# EAGLE schematic CKT-2000 (EAGLE 9.6.0)
DWG_NUMBER: CKT-2000; REV: B; TITLE: PIMtector Control Board
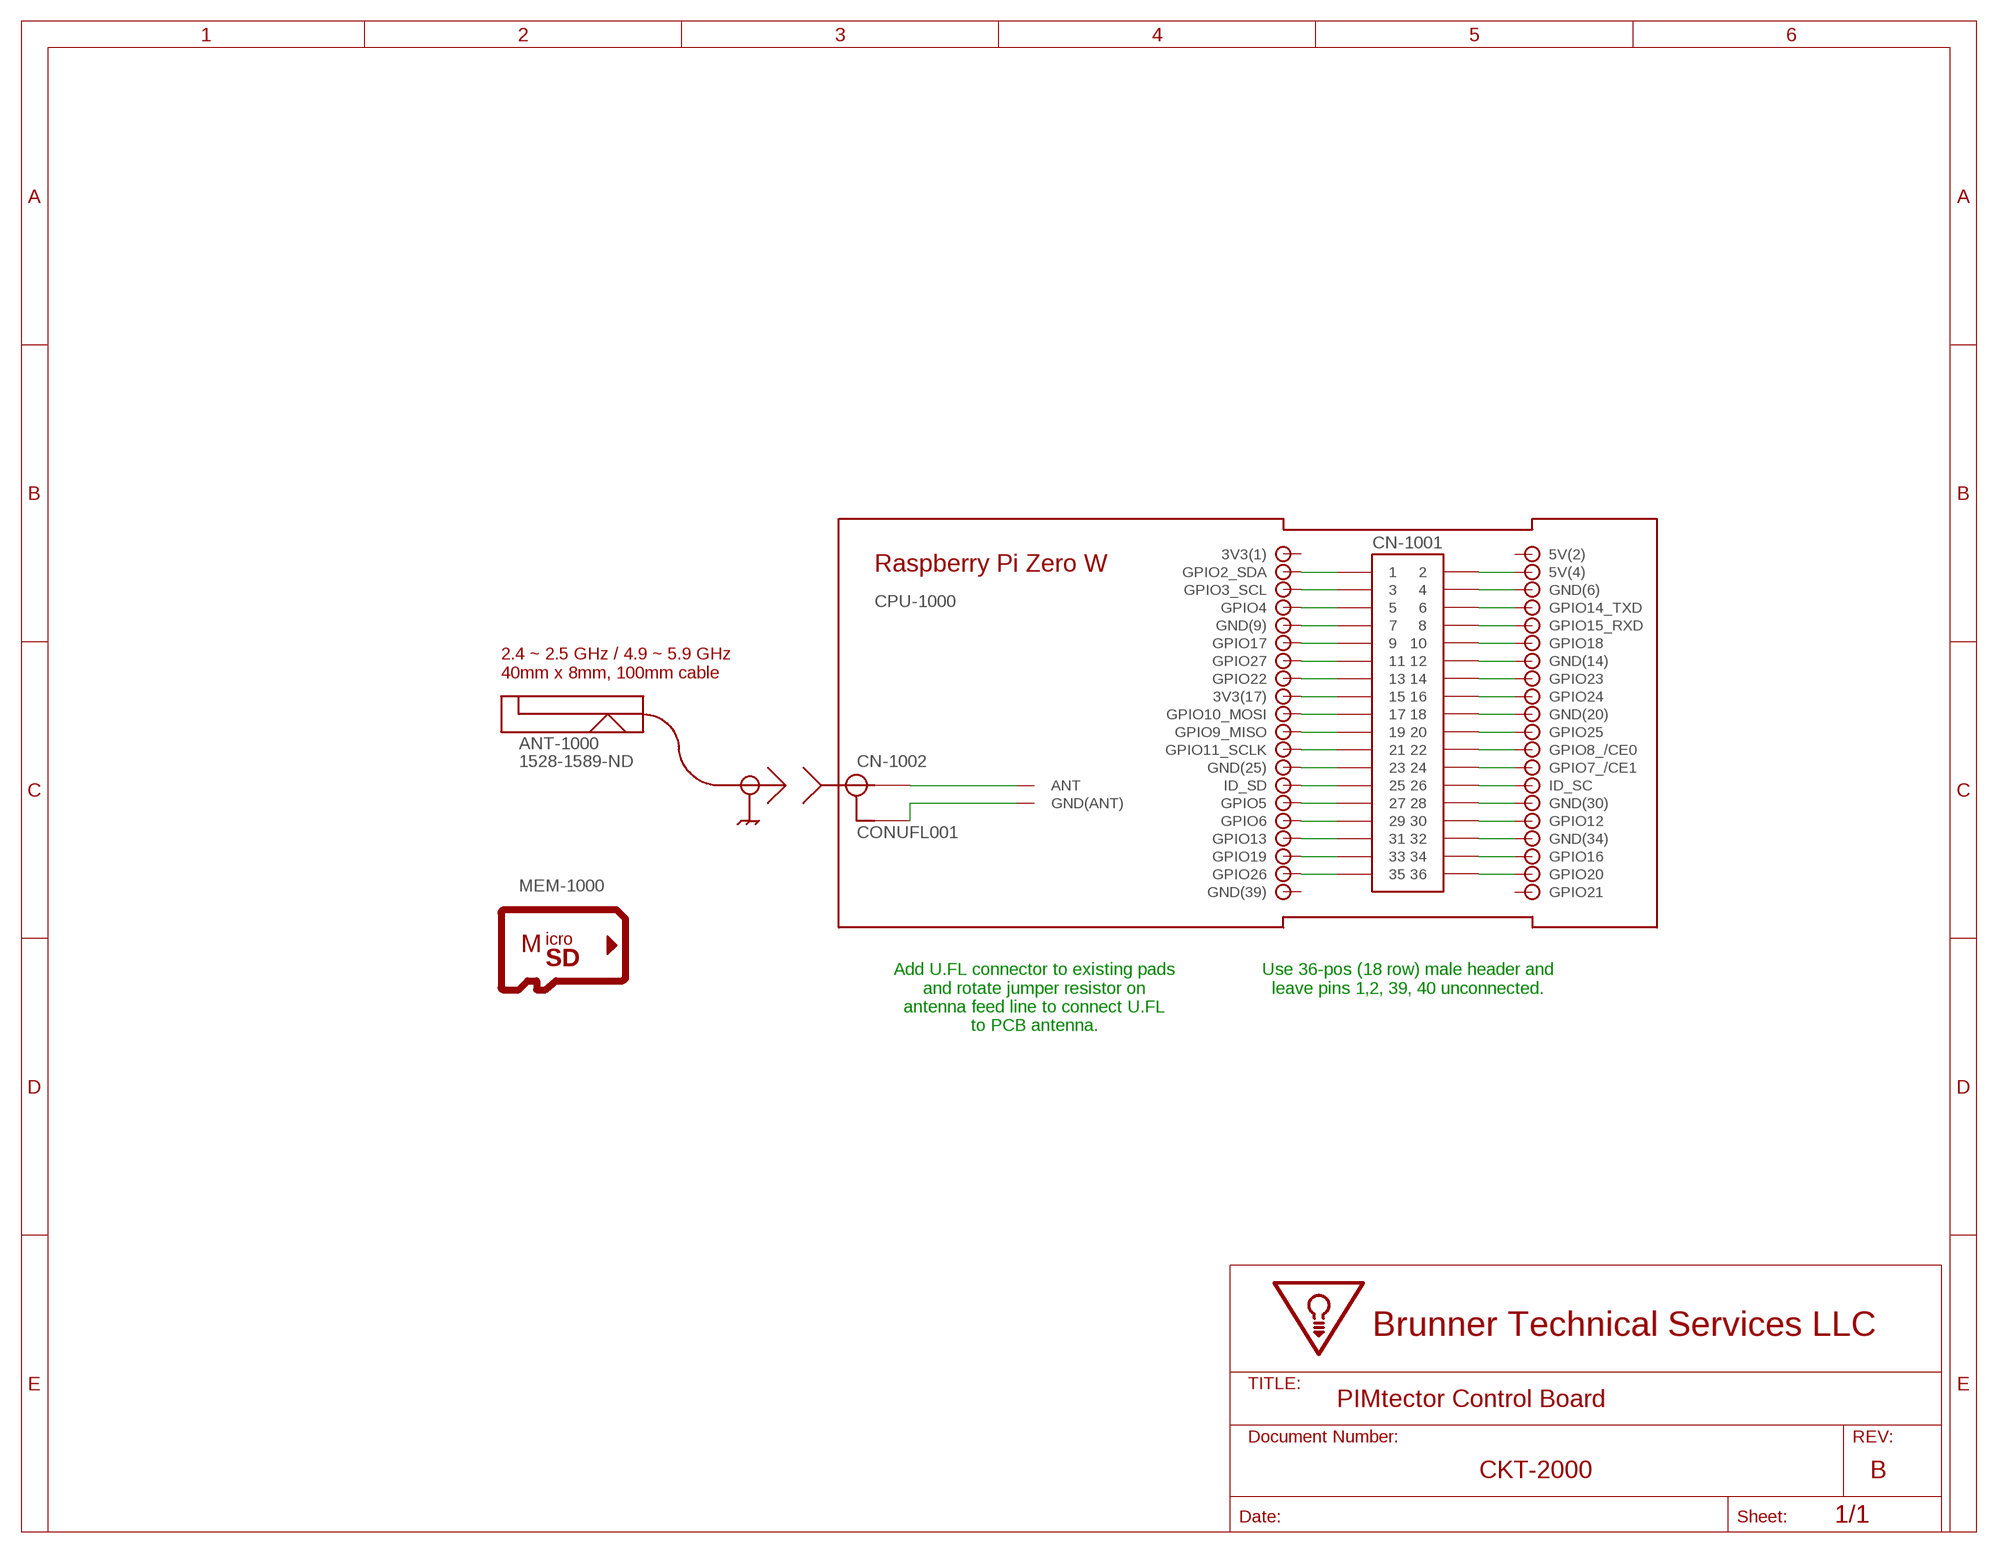
[diagram p0: schematic, sheet 1]
FRAME1 (FRAME_A_L): DWG_NUMBER: CKT-2000; REV: B; TITLE: PIMtector Control Board

## Parts
CN-1001  HEADER-FE-2X18  [HEADER-FE-2X18-TH]
CN-1002  CONUFL001  COAX_CONNECTORS  [CONUFL_UMC_SMD]
CPU-1000  RASPBERRY_PI_ZERO_W  [RASPBERRY_PI_ZERO_W]

## Nets
N$1: CN-1001.P$1 CPU-1000.P$3(GPIO2_SDA)
N$2: CN-1001.P$3 CPU-1000.P$5(GPIO3_SCL)
N$3: CN-1001.P$5 CPU-1000.P$7(GPIO4)
N$4: CN-1001.P$7 CPU-1000.P$9(GND(9))
N$5: CN-1001.P$9 CPU-1000.P$11(GPIO17)
N$6: CN-1001.P$11 CPU-1000.P$13(GPIO27)
N$7: CN-1001.P$13 CPU-1000.P$15(GPIO22)
N$8: CN-1001.P$15 CPU-1000.P$17(3V3(17))
N$9: CN-1001.P$17 CPU-1000.P$19(GPIO10_MOSI)
N$10: CN-1001.P$19 CPU-1000.P$21(GPIO9_MISO)
N$11: CN-1001.P$21 CPU-1000.P$23(GPIO11_SCLK)
N$12: CN-1001.P$23 CPU-1000.P$25(GND(25))
N$13: CN-1001.P$25 CPU-1000.P$27(ID_SD)
N$14: CN-1001.P$27 CPU-1000.P$29(GPIO5)
N$15: CN-1001.P$29 CPU-1000.P$31(GPIO6)
N$16: CN-1001.P$31 CPU-1000.P$33(GPIO13)
N$17: CN-1001.P$33 CPU-1000.P$35(GPIO19)
N$18: CN-1001.P$35 CPU-1000.P$37(GPIO26)
N$19: CN-1001.P$2 CPU-1000.P$4(5V(4))
N$20: CN-1001.P$4 CPU-1000.P$6(GND(6))
N$21: CN-1001.P$6 CPU-1000.P$8(GPIO14_TXD)
N$22: CN-1001.P$8 CPU-1000.P$10(GPIO15_RXD)
N$23: CN-1001.P$10 CPU-1000.P$12(GPIO18)
N$24: CN-1001.P$12 CPU-1000.P$14(GND(14))
N$25: CN-1001.P$14 CPU-1000.P$16(GPIO23)
N$26: CN-1001.P$16 CPU-1000.P$18(GPIO24)
N$27: CN-1001.P$18 CPU-1000.P$20(GND(20))
N$28: CN-1001.P$20 CPU-1000.P$22(GPIO25)
N$29: CN-1001.P$22 CPU-1000.P$24(GPIO8_/CE0)
N$30: CN-1001.P$24 CPU-1000.P$26(GPIO7_/CE1)
N$31: CN-1001.P$26 CPU-1000.P$28(ID_SC)
N$32: CN-1001.P$28 CPU-1000.P$30(GND(30))
N$33: CN-1001.P$30 CPU-1000.P$32(GPIO12)
N$34: CN-1001.P$32 CPU-1000.P$34(GND(34))
N$35: CN-1001.P$34 CPU-1000.P$36(GPIO16)
N$36: CN-1001.P$36 CPU-1000.P$38(GPIO20)
N$37: CN-1002.P$1 CPU-1000.P$41(ANT)
N$38: CN-1002.P$2 CN-1002.P$3 CPU-1000.P$42(GND(ANT)) CPU-1000.P$43(GND(ANT))
Unconnected: CPU-1000.P$40(GPIO21)

## Notes on the sheet
- Add U.FL connector to existing pads
  and rotate jumper resistor on
  antenna feed line to connect U.FL
  to PCB antenna.
- Use 36-pos (18 row) male header and
  leave pins 1,2, 39, 40 unconnected.

## Power pins joined to a net without a drawn wire
3V3(1): CPU-1000.P$1(3V3(1))
5V(2): CPU-1000.P$2(5V(2))
GND(39): CPU-1000.P$39(GND(39))

## Library data of the parts
CN-1001 = brunnertech:HEADER-FE-2X18
CN-1002 = brunnertech:COAX_CONNECTORS
CPU-1000 = brunnertech:RASPBERRY_PI_ZERO_W